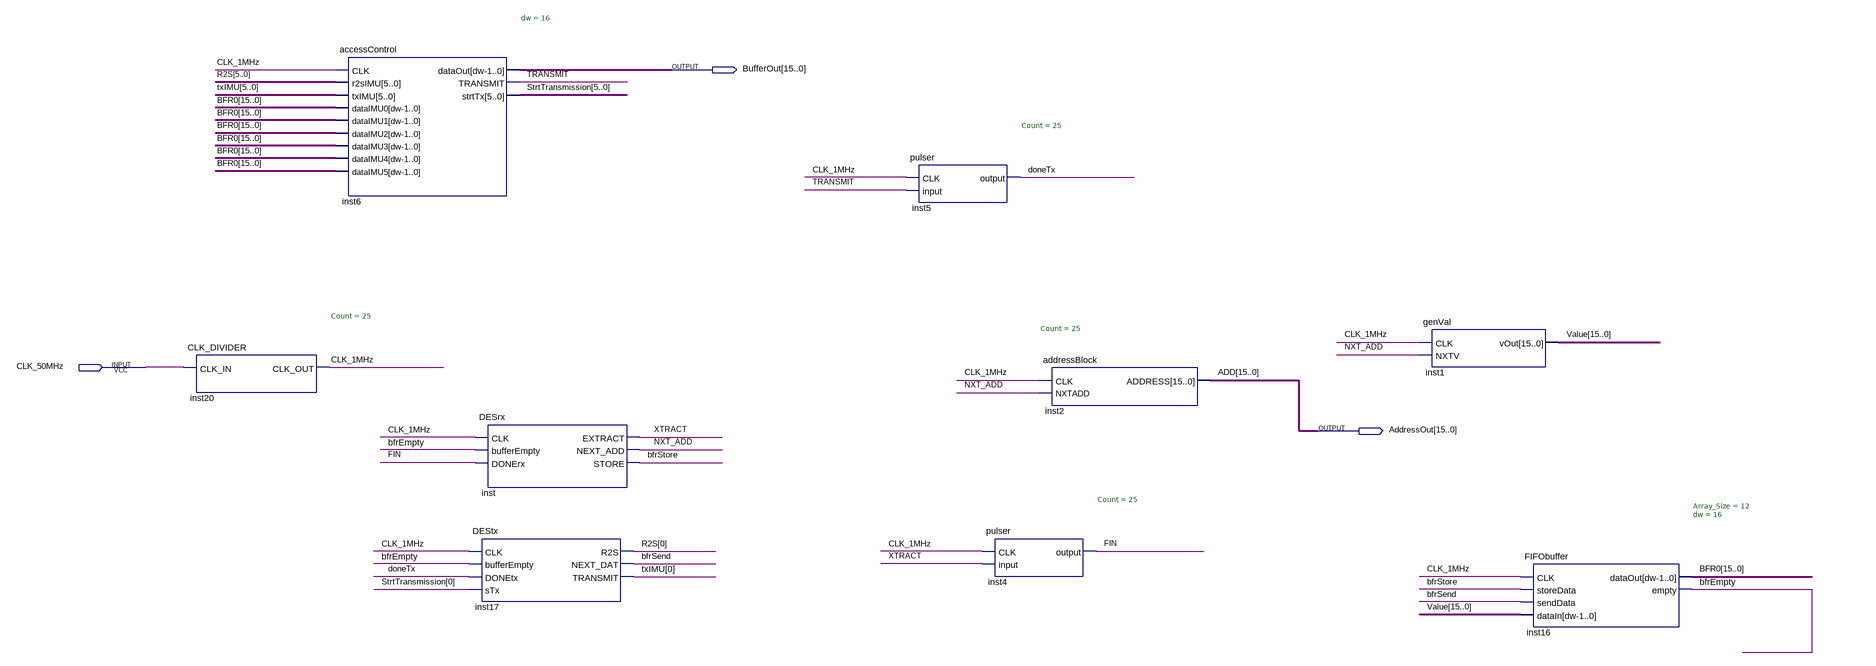
[diagram p0: schematic sheet]
// Quartus schematic SystemTest.bdf as structural Verilog: 9 symbols, 3 pins
module SystemTest (
  input  CLK_50MHz,
  output [15:0] BufferOut,
  output [15:0] AddressOut
);

  wire bfrEmpty, bfrSend, bfrStore, CLK_1MHz, doneTx, FIN, NXT_ADD, TRANSMIT, XTRACT;
  wire [5:0] R2S, StrtTransmission, txIMU;
  wire [15:0] BFR0, Value;

  CLK_DIVIDER #(.Count(25)) inst20 (.CLK_IN(CLK_50MHz), .CLK_OUT(CLK_1MHz));
  accessControl #(.dw(16)) inst6 (
    .CLK(CLK_1MHz), .r2sIMU(R2S), .txIMU(txIMU), .dataIMU0(BFR0), .dataIMU1(BFR0), .dataIMU2(BFR0),
    .dataIMU3(BFR0), .dataIMU4(BFR0), .dataIMU5(BFR0), .dataOut(BufferOut), .TRANSMIT(TRANSMIT),
    .strtTx(StrtTransmission));
  DESrx inst (
    .CLK(CLK_1MHz), .bufferEmpty(bfrEmpty), .DONErx(FIN), .EXTRACT(XTRACT), .NEXT_ADD(NXT_ADD),
    .STORE(bfrStore));
  DEStx inst17 (
    .CLK(CLK_1MHz), .bufferEmpty(bfrEmpty), .DONEtx(doneTx), .sTx(StrtTransmission[0]), .R2S(R2S[0]),
    .NEXT_DAT(bfrSend), .TRANSMIT(txIMU[0]));
  pulser #(.Count(25)) inst5 (.CLK(CLK_1MHz), .\input (TRANSMIT), .\output (doneTx));
  pulser #(.Count(25)) inst4 (.CLK(CLK_1MHz), .\input (XTRACT), .\output (FIN));
  addressBlock #(.Count(25)) inst2 (.CLK(CLK_1MHz), .NXTADD(NXT_ADD), .ADDRESS(AddressOut));
  genVal inst1 (.CLK(CLK_1MHz), .NXTV(NXT_ADD), .vOut(Value));
  FIFObuffer #(.Array_Size(12), .dw(16)) inst16 (
    .CLK(CLK_1MHz), .storeData(bfrStore), .sendData(bfrSend), .dataIn(Value), .dataOut(BFR0), .empty(bfrEmpty));

  // Other names for the same wires on the sheet: ADD[15:0] = AddressOut
endmodule
